# Altium project STM32_CAN_Telemetry_Node.PrjPcb
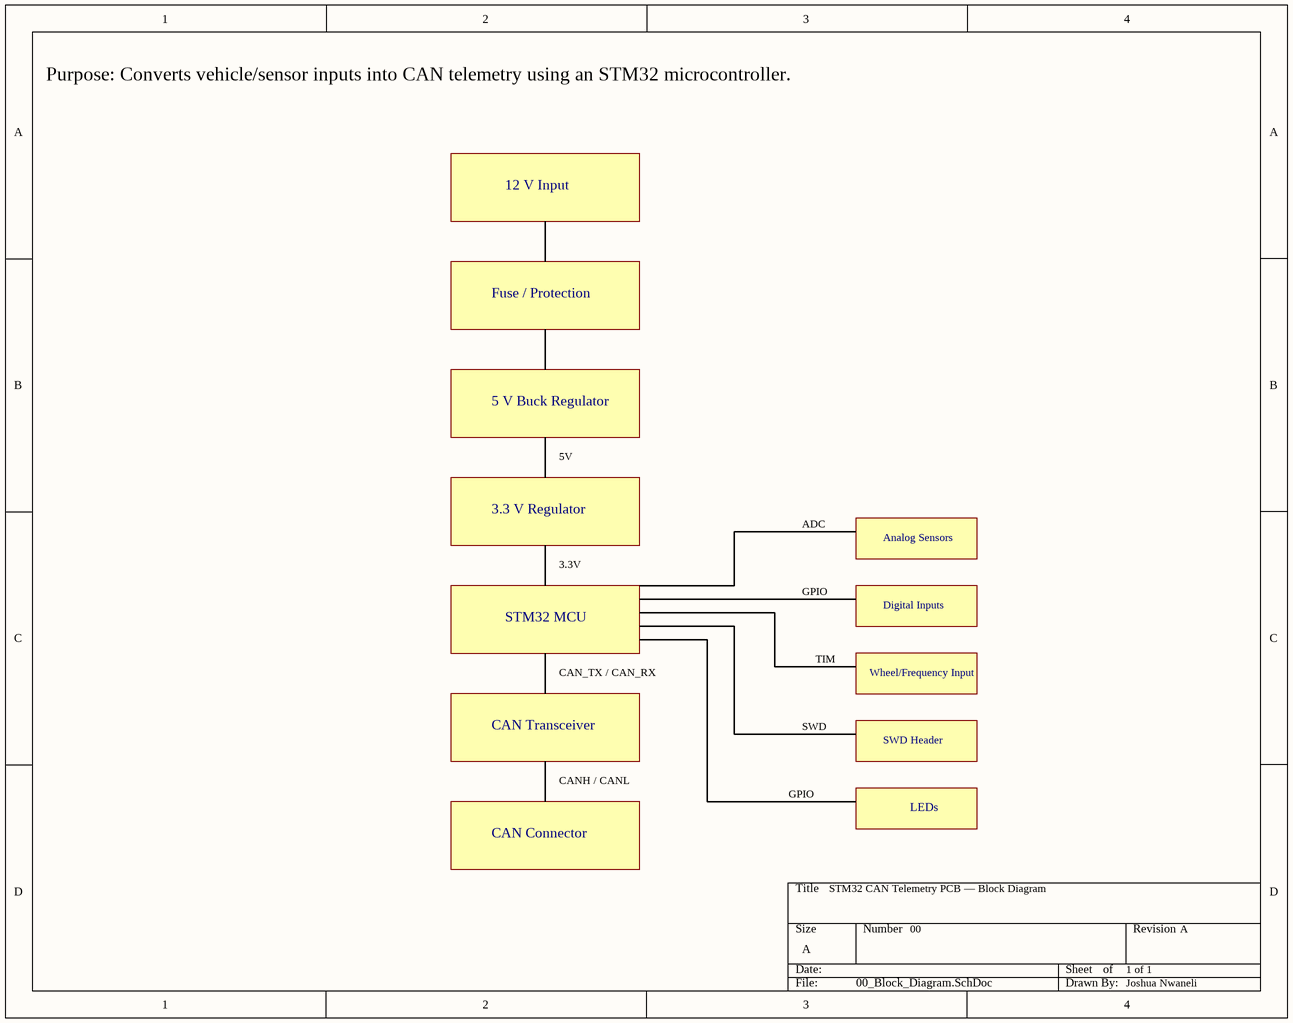
[diagram p0: 00_Block_Diagram.SchDoc]
6 sheets, 72 parts. Net scope: global (net labels, ports and power ports of the same name join across sheets).
Board file: STM32_CAN_Telemetry_Node.PcbDoc
Sheets:
  00_Block_Diagram.SchDoc
  01_Power.SchDoc
  02_MCU.SchDoc
  03_CAN.SchDoc
  04_Sensors_IO.SchDoc
  05_Connectors_Debug.SchDoc

## Sheet 00_Block_Diagram.SchDoc
size A; SheetNumber: 1; SheetTotal: 6

### Notes on the sheet
- Purpose: Converts vehicle/sensor inputs into CAN telemetry using an STM32 microcontroller.
- 12 V Input
- Fuse / Protection
- 5 V Buck Regulator
- 5V
- 3.3 V Regulator
- 3.3V
- ADC
- Analog Sensors
- STM32 MCU
- GPIO
- Digital Inputs
- CAN_TX / CAN_RX
- TIM
- Wheel/Frequency Input
- CAN Transceiver
- SWD
- SWD Header
- CAN Connector
- CANH / CANL
- LEDs
- STM32 CAN Telemetry PCB — Block Diagram
- 00
- 1 of 1
- A
- Joshua Nwaneli

## Sheet 01_Power.SchDoc
size A; SheetNumber: 2; SheetTotal: 6
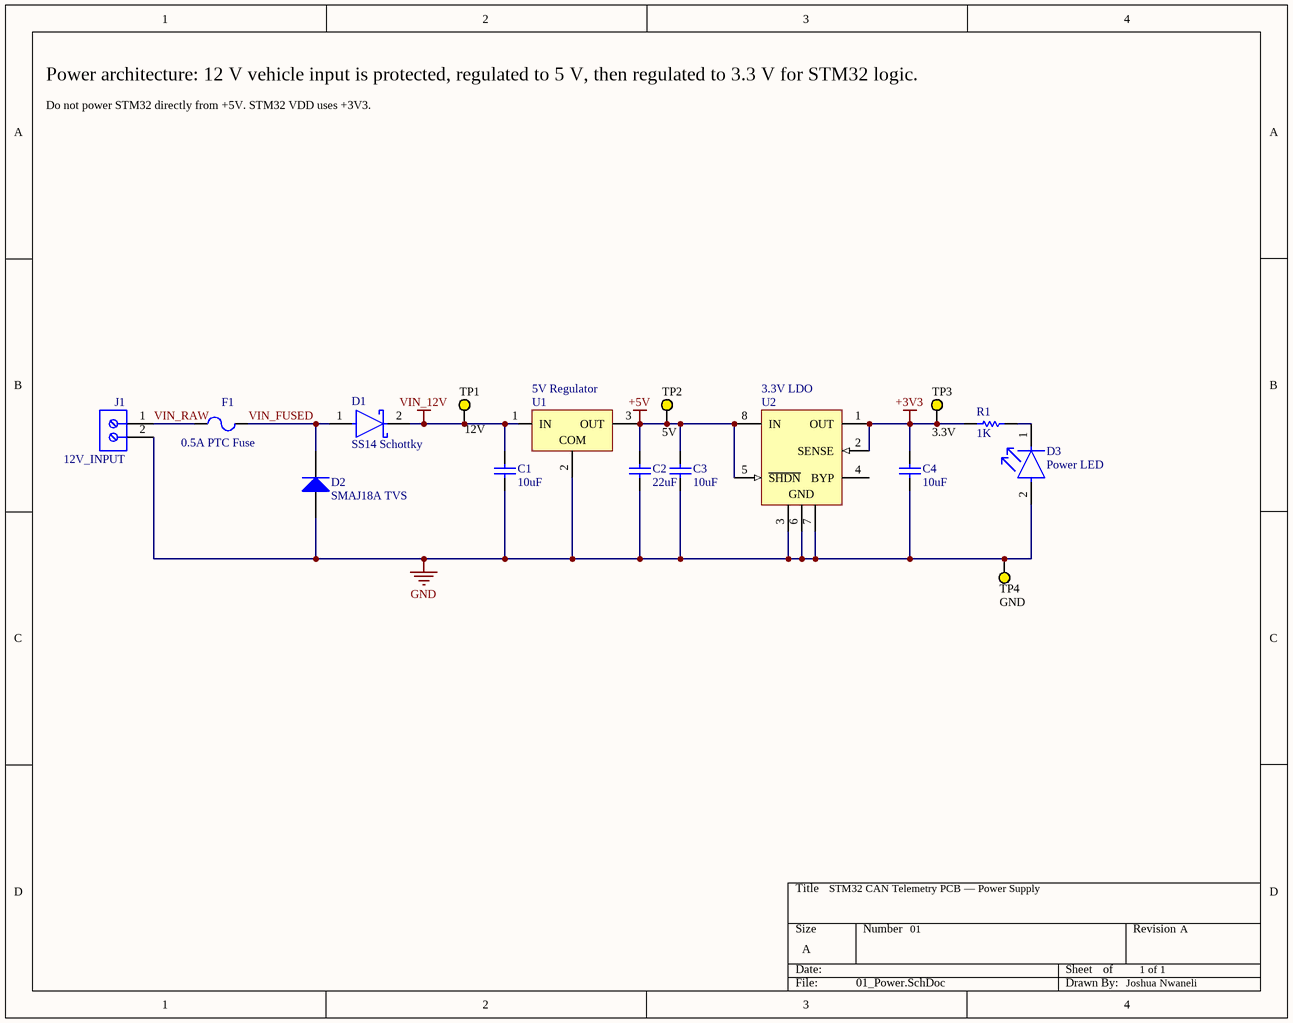
[diagram p1: 01_Power.SchDoc]

### Parts
C1  10uF  [CAPC2013X140X50ML20T25]
C2  22uF  [CAPC1206(3216)190_N]
C3  10uF  [CAPC2013X140X50ML20T25]
C4  10uF  [CAPC2013X140X50ML20T25]
D1  SS14 Schottky  [FP-403AE-MFG]
D2  SMAJ18A TVS  [VISH-DO-214AC-2_M]
D3  Power LED  [FP-SML-LXT0805IW-TR-MFG]
F1  0.5A PTC Fuse  [LFUS-1812L05030PR_V]
J1  12V_INPUT  [691249510002]
R1  1K  [RESC2013X50X30ML20T20]
TP1  12V  [KSTN-5014_V]
TP2  5V  [KSTN-5014_V]
TP3  3.3V  [KSTN-5014_V]
TP4  GND  [KSTN-5014_V]
U1  5V Regulator  [LP3]
U2  3.3V LDO  [LT-S8-8_N]

### Nets
+3V3: C4.2 R1.1 TP3.1 U2.1(OUT) U2.2(SENSE)
+5V: C2.1 C3.2 TP2.1 U1.3(OUT) U2.5(~{SHDN}) U2.8(IN)
GND: C1.1 C2.2 C3.1 C4.1 D2.2(A) D3.2(A) J1.2 TP4.1 U1.2(COM) U2.3(GND) U2.6(GND) U2.7(GND)
VIN_12V: C1.2 D1.2(C) TP1.1 U1.1(IN)
VIN_FUSED: D1.1(A) D2.1(K) F1.2
VIN_RAW: F1.1 J1.1
NetD3_1: D3.1(C) R1.2

Not connected (* = marked no-connect by the designer): U2 4(BYP)

### Notes on the sheet
- Power architecture: 12 V vehicle input is protected, regulated to 5 V, then regulated to 3.3 V for STM32 logic.
- Do not power STM32 directly from +5V. STM32 VDD uses +3V3.
- STM32 CAN Telemetry PCB — Power Supply
- 01
- 1 of 1
- A
- Joshua Nwaneli

### Library data of the parts
C1 C3 C4 = CMP-2007-04702-1: Manufacturer: AVX Interconnect / Elco; Part Number: 0805ZC106KAT2A
C2 = CMP-1037-04990-1: CAP 22uF 10V ±20% 1206 (3216 Metric) Thickness 1.9mm SMD; Tolerance: Â±20%; Case-EIA: 1206; Case-Metric: 3216; Rated Voltage: 10 V; Max Thickness: 1.9 mm; Technology: SMT; Value: 22uF
D1 = CMP-2000-04943-2: DIODE SCHOTTKY 40V 1A SMA; Manufacturer: ON Semiconductor; Peak Reverse Current: 0.2mA; Max Junction Temp: +125°C; Standoff Height: 0.05mm; Max Surge Forward Current: 40A; Mouser Description: Schottky Diodes & Rectifiers SMA 40V 1.0A; RoHS: TRUE; Lead Free: Yes; Manufacturer Part Number: SS14; Device Class L3: Schottky Diodes; Category: Diode; Automotive: No; Digikey Description: DIODE SCHOTTKY 40V 1A SMA; ComponentLink2Description: Datasheet; Device Class L2: Diodes; Height: 2.5mm; Temperature Range High: +125°C; ComponentLink2URL: https://www.onsemi.com/pub/Collateral/SS19-D.PDF; Device Class L1: Discrete Semiconductors; Package: 403AE; Octopart: https://octopart.com/ss14-on+semiconductor-29205033; Max Repetitive Reverse Voltage: 40V; Temperature Range Low: -65°C; Forward Current: 1A; Temperature: -65°C to +125°C
D2 = CMP-0548-00222-2: Transient Voltage Suppressor, 6.40 to 231 V, 18 V Stand-off Voltage, Uni-Directional, -55 to 155 degC, 2-pin DO-214AC, Pb-Free, Tape and Reel; Manufacturer: Vishay Semiconductor; PartNumber: SMAJ18A-E3/61; IFSM: 40 A; PPPM (W): 400, 300; ID (uA): 1; VWM (V): 18; VBR Uni-Directional (V): 6.4 to 231; ComponentLink1URL: http://www.vishay.com/; ComponentLink3URL: http://www.vishay.com/docs/88390/smaj50a.pdf; RoHS: TRUE; Operating Junction and Storage Temperature Range: -55 to 150 degC; ComponentLink2URL: http://www.vishay.com/docs/88390/smaj50a.pdf; ComponentLink1Description: Manufacturer URL; Mounting Technology: Surface Mount; DatasheetVersion: 12/8/2013; PackageDescription: 2-Pin DO-214AC (SMA), Body 4.245 x 2.665 mm; Packing: Tape and Reel; ComponentLink3Description: Package Specification; ComponentLink2Description: Datasheet; PackageReference: DO-214AC-2
D3 = CMP-1724-00002-2: LED RED DIFFUSED SMD; Lens Style: Rectangular; Luminous Intensity: 11mcd; Approvals: UL; Test Current: 20mA; Forward Voltage: 2V; Number of LEDs: 1; Wavelength: 635nm; Lens Color: White; Viewing Angle: 140°; Min Operating Temperature: -25°C; Case Code (Metric): 2012; Mount: Surface Mount; Case Code (Imperial): 0805; Height: 0.8mm; Lead Free: Lead Free; Color: Red; Package Quantity: 1; Illumination Color: Red; Lens Transparency: Diffused; Forward Current: 20mA; Packaging: Tape and Reel; Length: 2mm; Case/Package: 0805; REACH SVHC: No SVHC; Width: 1.25mm; Number of Pins: 2; Max Operating Temperature: 80°C; Dominant Wavelength: 635nm
F1 = CMP-2000-05508-1: PTC Resettable Fuse, 0.8 W, 30 V, -40 to 85 degC, 2-Pin SMD, RoHS, Tape and Reel; Manufacturer: Littelfuse-Inc.; Voltage - Max: 30V; Current - Hold (Ih) (Max): 500mA; Time to Trip: 0.15s; Current - Max: 100A; R Min/Max: 0.150~1.000Ohm; Current - Trip (It): 1A; Package Reference: 1812; Family: PTCResettableFuses; Packaging: Tape&Reel(TR); Package / Case: 1812(4532Metric),Concave; Series: POLY-FUSE®,1812L; Mounting Technology: SurfaceMount; Datasheet Version: 02/2016; Datasheet URL: http://www.littelfuse.com/~/media/electronics/datasheets/resettable_ptcs/littelfuse_ptc_1812l_datasheet.pdf.pdf; Manufacturer URL: http://www.littelfuse.com/; Category: CircuitProtection; Package Description: 2-Pin Surface Mount Device, Body 4.55 x 3.24 mm
J1 = CMP-03913-78871301-2: Terminal Block, 5.08MM Pitch, Double Level Horizontal, 12-30 AWG, 2 Pin; Lead Pitch: 5.08mm; Number of Pins: 2; Packaging: Box
R1 = CMP-2001-04268-1: Manufacturer: Vishay Dale; Part Number: CRCW08051K00FKTC
TP1 = CMP-1672-00006-4: 12V Test Point; Manufacturer: Keystone; PackageDescription: 1-Pin Through Hole Device, Dia 3.17 mm; REACH SVHC: No SVHC; ComponentLink2Description: Datasheet; ComponentLink2URL: http://www.keyelco.com/product-pdf.cfm?p=1323; Package Quantity: 100; Colour: Yellow; Height: 8.12 mm; RoHSCompliant: true; Contact Material: Bronze; Mount: Through Hole; Contact Plating: Silver; ComponentLink1URL: http://www.keyelco.com/; Packaging: Bulk; Mounting Technology: Through Hole; PackageReference: 5014; ComponentLink1Description: Manufacturer URL; DatasheetVersion: Rev. F, 12/2013
TP2 = CMP-1672-00006-4: 5V Test Point; Manufacturer: Keystone; PackageDescription: 1-Pin Through Hole Device, Dia 3.17 mm; REACH SVHC: No SVHC; ComponentLink2Description: Datasheet; ComponentLink2URL: http://www.keyelco.com/product-pdf.cfm?p=1323; Package Quantity: 100; Colour: Yellow; Height: 8.12 mm; RoHSCompliant: true; Contact Material: Bronze; Mount: Through Hole; Contact Plating: Silver; ComponentLink1URL: http://www.keyelco.com/; Packaging: Bulk; Mounting Technology: Through Hole; PackageReference: 5014; ComponentLink1Description: Manufacturer URL; DatasheetVersion: Rev. F, 12/2013
TP3 = CMP-1672-00006-4: 3.3V Test Point; Manufacturer: Keystone; PackageDescription: 1-Pin Through Hole Device, Dia 3.17 mm; REACH SVHC: No SVHC; ComponentLink2Description: Datasheet; ComponentLink2URL: http://www.keyelco.com/product-pdf.cfm?p=1323; Package Quantity: 100; Colour: Yellow; Height: 8.12 mm; RoHSCompliant: true; Contact Material: Bronze; Mount: Through Hole; Contact Plating: Silver; ComponentLink1URL: http://www.keyelco.com/; Packaging: Bulk; Mounting Technology: Through Hole; PackageReference: 5014; ComponentLink1Description: Manufacturer URL; DatasheetVersion: Rev. F, 12/2013
TP4 = CMP-1672-00006-4: Ground Test Point; Manufacturer: Keystone; PackageDescription: 1-Pin Through Hole Device, Dia 3.17 mm; REACH SVHC: No SVHC; ComponentLink2Description: Datasheet; ComponentLink2URL: http://www.keyelco.com/product-pdf.cfm?p=1323; Package Quantity: 100; Colour: Yellow; Height: 8.12 mm; RoHSCompliant: true; Contact Material: Bronze; Mount: Through Hole; Contact Plating: Silver; ComponentLink1URL: http://www.keyelco.com/; Packaging: Bulk; Mounting Technology: Through Hole; PackageReference: 5014; ComponentLink1Description: Manufacturer URL; DatasheetVersion: Rev. F, 12/2013
U1 = CMP-0324-00078-1: Regulates protected 12V input down to 5V; PartNumber: UA78M05IKCSE3; Manufacturer: Texas Instruments; Vout(Max)(V): 5; Eco-Plan: Pb-Free (RoHS); Iout(Max)(A): 0.5; Iq(Typ)(mA): 6; Vin(Max)(V): 25; Vin(Min)(V): 7; ComponentLink2Description: URL Link1; PackageDescription: Plastic Cylindrical Package, Formed Lead Option (TO-92); Mounting Technology: Through Hole; Vout(Min)(V): 5; PackageVersion: revC, Oct-2001; PackageReference: LP3; Code_JEDEC: TO-226-AA; ComponentLink1URL: http://www.ti.com/general/docs/lit/getliterature.tsp?genericPartNumber=UA78M05&fileType=pdf; DatasheetVersion: SLVS059Q; ComponentLink2URL: Samples URL:http://www.ti.com/product/ua78m05#samples; ComponentLink1Description: Datasheet
U2 = CMP-0476-01566-1: 500 mA, Low Noise, LDO Micropower Regulator, 1.8 to 20 V Vin, 3.3 V Vout, 8-pin SOIC (S8-8), -40 to 125 degC, Pb-Free; Manufacturer: Linear Technology; PartNumber: LT1763IS8-3.3#PBF; Shutdown Current(uA): 1; Vin Min(V): 1.8; Iout(mA): 500; Noise(uV): 20; Isupply(mA): 0.03; Discrete Pass Element: no; PSRR(dB): 65; Dropout Voltage(V): 0.3; ComponentLink3URL: http://cds.linear.com/docs/en/packaging/05081610_G_SO8.pdf; Number of Outputs: 1; ComponentLink2URL: http://cds.linear.com/docs/en/datasheet/1763fg.pdf; ComponentLink1Description: Manufacturer URL; PackageReference: S8-8; DatasheetVersion: Rev. G; ComponentLink3Description: Package Specification; ComponentLink2Description: Datasheet; Output Voltage: 3.3 V; Mounting Technology: Surface Mount; Vin Max(V): 20; ComponentLink1URL: http://www.linear.com/; PackageDescription: 8-Pin Plastic Small Outline (Narrow .150 Inch), Body 4.9 x 3.9 mm, Pitch 1.27 mm; RoHS: TRUE; PackageVersion: Rev. G, 03/2012

## Sheet 02_MCU.SchDoc
size A; SheetNumber: 3; SheetTotal: 6
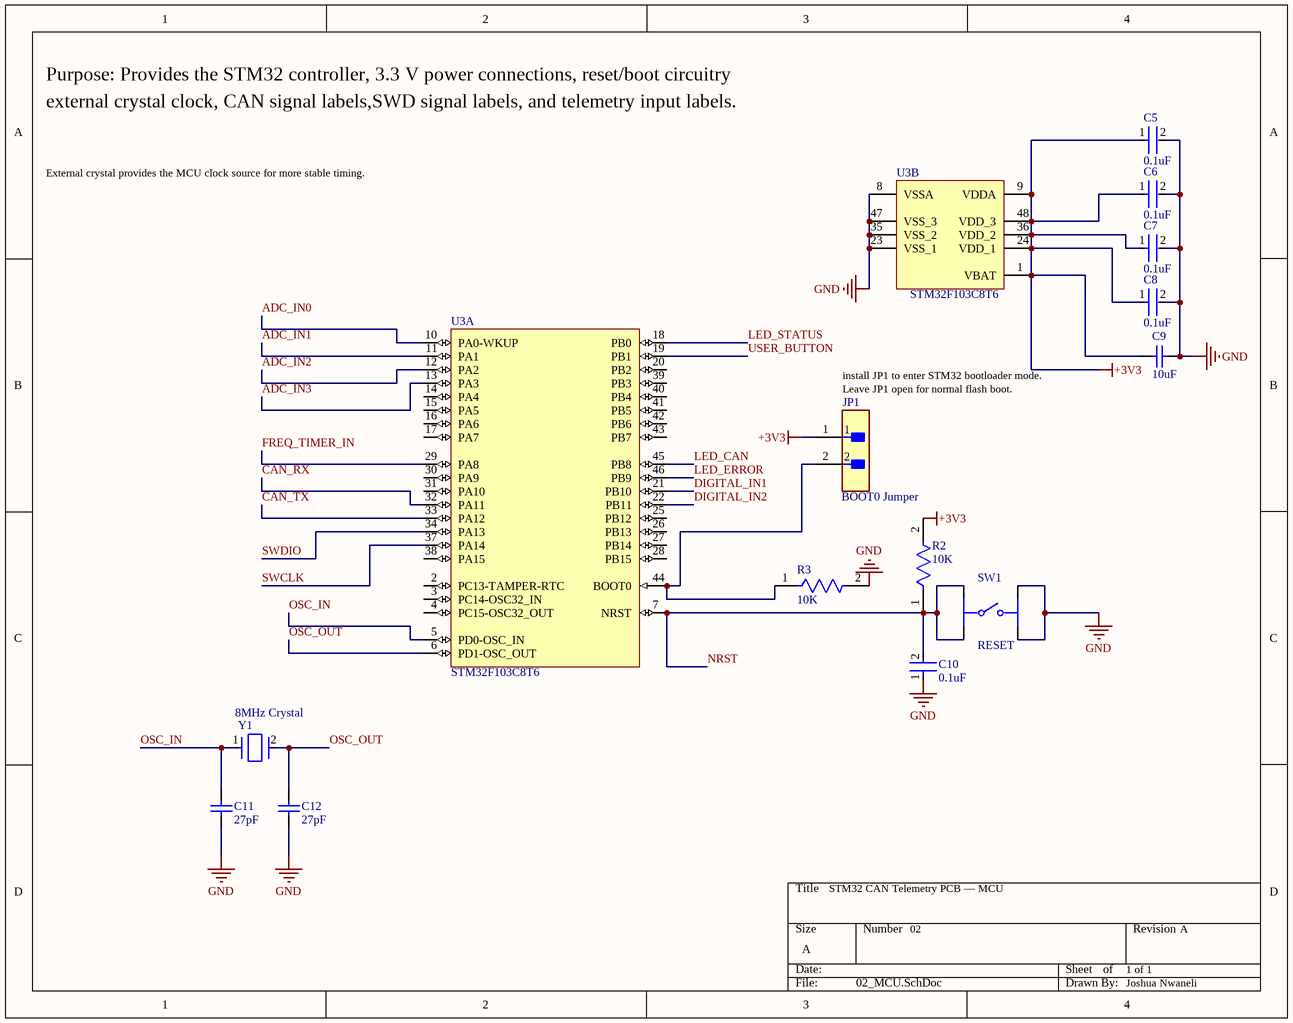
[diagram p2: 02_MCU.SchDoc]

### Parts
C5  0.1uF  [FP-CC0805-EB-MFG]
C6  0.1uF  [FP-CC0805-EB-MFG]
C7  0.1uF  [FP-CC0805-EB-MFG]
C8  0.1uF  [FP-CC0805-EB-MFG]
C9  10uF  [CAPC2013X140X50ML20T25]
C10  0.1uF  [FP-CC0805-EB-MFG]
C11  27pF  [CAPC0603X33X15ML03T05]
C12  27pF  [CAPC0603X33X15ML03T05]
JP1  BOOT0 Jumper  [FP-TSW-102-12-T-S-MFG]
R2  10K  [FP-CRGP0805-IPC_C]
R3  10K  [FP-CRGP0805-IPC_C]
SW1  RESET  [FP-7914J-1-032-MFG]
U3  STM32F103C8T6  [STM-LQFP48_L]  (parts A,B of 2)
Y1  8MHz Crystal  [FP-ABLS-MFG]

### Nets
+3V3: C5.1 C6.1 C7.1 C8.1 C9.2 JP1.1 R2.2 U3.1(VBAT) U3.9(VDDA) U3.24(VDD_1) U3.36(VDD_2) U3.48(VDD_3)
GND: C5.2 C6.2 C7.2 C8.2 C9.1 C10.1 C11.1 C12.1 R3.2 SW1.1_2+(1_2+) SW1.2_2+(2_2+) U3.8(VSSA) U3.23(VSS_1) U3.35(VSS_2) U3.47(VSS_3)
ADC_IN0: U3.10(PA0-WKUP)
ADC_IN1: U3.11(PA1)
ADC_IN2: U3.12(PA2)
ADC_IN3: U3.13(PA3)
CAN_RX: U3.32(PA11)
CAN_TX: U3.33(PA12)
DIGITAL_IN1: U3.21(PB10)
DIGITAL_IN2: U3.22(PB11)
FREQ_TIMER_IN: U3.29(PA8)
LED_CAN: U3.45(PB8)
LED_ERROR: U3.46(PB9)
LED_STATUS: U3.18(PB0)
NRST: C10.2 R2.1 SW1.1_1-(1_1-) SW1.2_1-(2_1-) U3.7(NRST)
OSC_IN: C11.2 U3.5(PD0-OSC_IN) Y1.1
OSC_OUT: C12.2 U3.6(PD1-OSC_OUT) Y1.2
SWCLK: U3.37(PA14)
SWDIO: U3.34(PA13)
USER_BUTTON: U3.19(PB1)
NetJP1_2: JP1.2 R3.1 U3.44(BOOT0)

Not connected (* = marked no-connect by the designer): U3 2(PC13-TAMPER-RTC) 3(PC14-OSC32_IN) 4(PC15-OSC32_OUT) 14(PA4) 15(PA5) 16(PA6) 17(PA7) 20(PB2) 25(PB12) 26(PB13) 27(PB14) 28(PB15) 30(PA9) 31(PA10) 38(PA15) 39(PB3) 40(PB4) 41(PB5) 42(PB6) 43(PB7)

### Notes on the sheet
- Purpose: Provides the STM32 controller, 3.3 V power connections, reset/boot circuitry
- external crystal clock, CAN signal labels,SWD signal labels, and telemetry input labels.
- External crystal provides the MCU clock source for more stable timing.
- install JP1 to enter STM32 bootloader mode.
- (near JP1) Leave JP1 open for normal flash boot.
- STM32 CAN Telemetry PCB — MCU
- 02
- 1 of 1
- A
- Joshua Nwaneli

### Library data of the parts
C5-C8 C10 = CMP-00621-107850848-1: CC0805KKX7RYBB104 Capacitor Ceramic 0.01uF 250V X7R 10% 0805 T/R; Capacitance: 100nF; Material: Ceramic; Max Operating Temperature: 125°C; Tolerance: 10%; Case/Package: 0805; NexarPartId: 107850848; Height: 1.45mm; Min Operating Temperature: -55°C; Voltage Rating: 250V
C9 = CMP-2007-04702-1: as C1 on sheet 01_Power
C11 C12 = CMP-2010-00173-1: Manufacturer: AVX Interconnect / Elco; Part Number: 0201YA270JAT2A
JP1 = CMP-02766-001444-1: CONN HEADER VERT 2POS 2.54MM; Gender: Male; Number of Contacts: 2; RoHS Compliant: Yes; Mount: Through Hole; Termination: Solder; Packaging: Bulk; Contact Material: Bronze; Contact Plating: Tin; Number of Rows: 1; REACH SVHC: No SVHC; Pitch: 2.54mm; Radiation Hardening: No
R2 R3 = CMP-03211-006861-1: CRGP 0805 10K 1%; Manufacturer Part Number: CRGP0805F10K; Manufacturer: TE; Power Rating: 0.33W; Description: CRGP0805 10KΩ 0.33W ±100ppm/°C 1% 150V; Voltage Rating: 150V; Value: 10KΩ; Tolerance: 0.01; Temperature Coefficient: ±100ppm/°C; ComponentLink2URL: https://www.mouser.com/datasheet/2/418/NG_DS_9-1773463-9_A-1358566.pdf; Temperature Range Low: -55°C; Ipc Land Pattern Name: RESC200125X55; Device Class L2: Resistors; Automotive: No; Device Class L3: Chip SMD Resistors; Composition: Thick Film; Temperature Range High: +155°C; Temperature: -55°C to +155°C; Height: 0.65mm; Series: CRGP; RoHS: TRUE; Device Class L1: Passive Components; Octopart: https://octopart.com/crgp0805f10k-te+connectivity-91018782; Package: CRGP0805; Digikey Description: CRGP 0805 10K 1%; Ambient Temperature Range High: +70°C; Lead Free: Yes; ComponentLink2Description: Datasheet; Category: Res; Resistance: 10KΩ
SW1 = CMP-07427-000007-1: Normally open reset pushbutton for STM32 NRST; Mechanical Life: 100000Cycles; Switch Function: Off-Mom; Actuator Material: Rubber; Illumination Type: Non-Illuminated; Actuator Type: Standard; Operating Force: 300gf; Throw Configuration: SPST; Current Rating: 100mA; Voltage Rating (DC): 16V; Contact Plating: Silver; Min Operating Temperature: -55°C; Series: 7914; Package Quantity: 50; Max Operating Temperature: 125°C; Depth: 5mm; Termination: J-Hook; Mount: Surface Mount; RoHS Compliant: Yes; Case/Package: SMD/SMT; Orientation: Straight; Max Current Rating: 100mA; Packaging: Rail/Tube; Length: 5mm; Contact Material: Gold
U3 = CMP-0237-00215-3: ARM Cortex-M3 32-bit MCU, 64 KB Flash, 20 KB Internal RAM, 37 I/Os, 48-pin LQFP, -40 to 85 degC, Tray; Supply Voltage(Vcc) min (V): 2; Internal RAM Size (kB): 20; FLASH Size (Prog) (kB): 64; A/D Converter: 2x12-bit (10 Channel); I/Os (High Current): 37; Operating Frequency(F) (Processor speed) (MHz): 72; Core: ARM Cortex-M3; ComponentLink3Description: Package Specification; Mounting Technology: Surface Mount; PartNumber: STM32F103C8T6; PackageReference: LQFP48; Packing: Tray; ComponentLink3URL: http://www.st.com/st-web-ui/static/active/en/resource/technical/document/datasheet/DM00058181.pdf; DatasheetVersion: Rev. 16; ComponentLink1URL: http://www.st.com/web/en/home.html; PackageVersion: Rev. 6, 06/2013; ComponentLink2URL: http://www.st.com/st-web-ui/static/active/en/resource/technical/document/datasheet/CD00161566.pdf; ComponentLink1Description: Manufacturer URL; ComponentLink2Description: Datasheet; PackageDescription: 48-Pin Low Profile Quad Flat Package, 7 x 7 mm Body, 0.5 mm Pitch
Y1 = CMP-27762-009874-1: CRYSTAL 8.0000MHZ 18PF SMD; ESR (Equivalent Series Resistance): 80R; Frequency Stability: 50ppm; Tolerance: 20ppm; Min Operating Temperature: -20°C; Lead Free: Lead Free; Operating Frequency: 8 MHz; Width: 4.7mm; Packaging: Tape and Reel; Series: ABLS; Accuracy: 20ppm; Length: 11.4mm; Frequency Tolerance: 20ppm; Termination: SMD/SMT; Number of Pins: 2; Radiation Hardening: No; Depth: 4.7mm; REACH SVHC: No SVHC; Contact Plating: Tin; Load Capacitance: 18pF; Case/Package: SMD/SMT; Mount: Surface Mount; Package Quantity: 1000; Max Operating Temperature: 70°C; Height: 0.165inch; Frequency: 8MHz; Series Resistance: 80R

## Sheet 03_CAN.SchDoc
size A; SheetNumber: 4; SheetTotal: 6
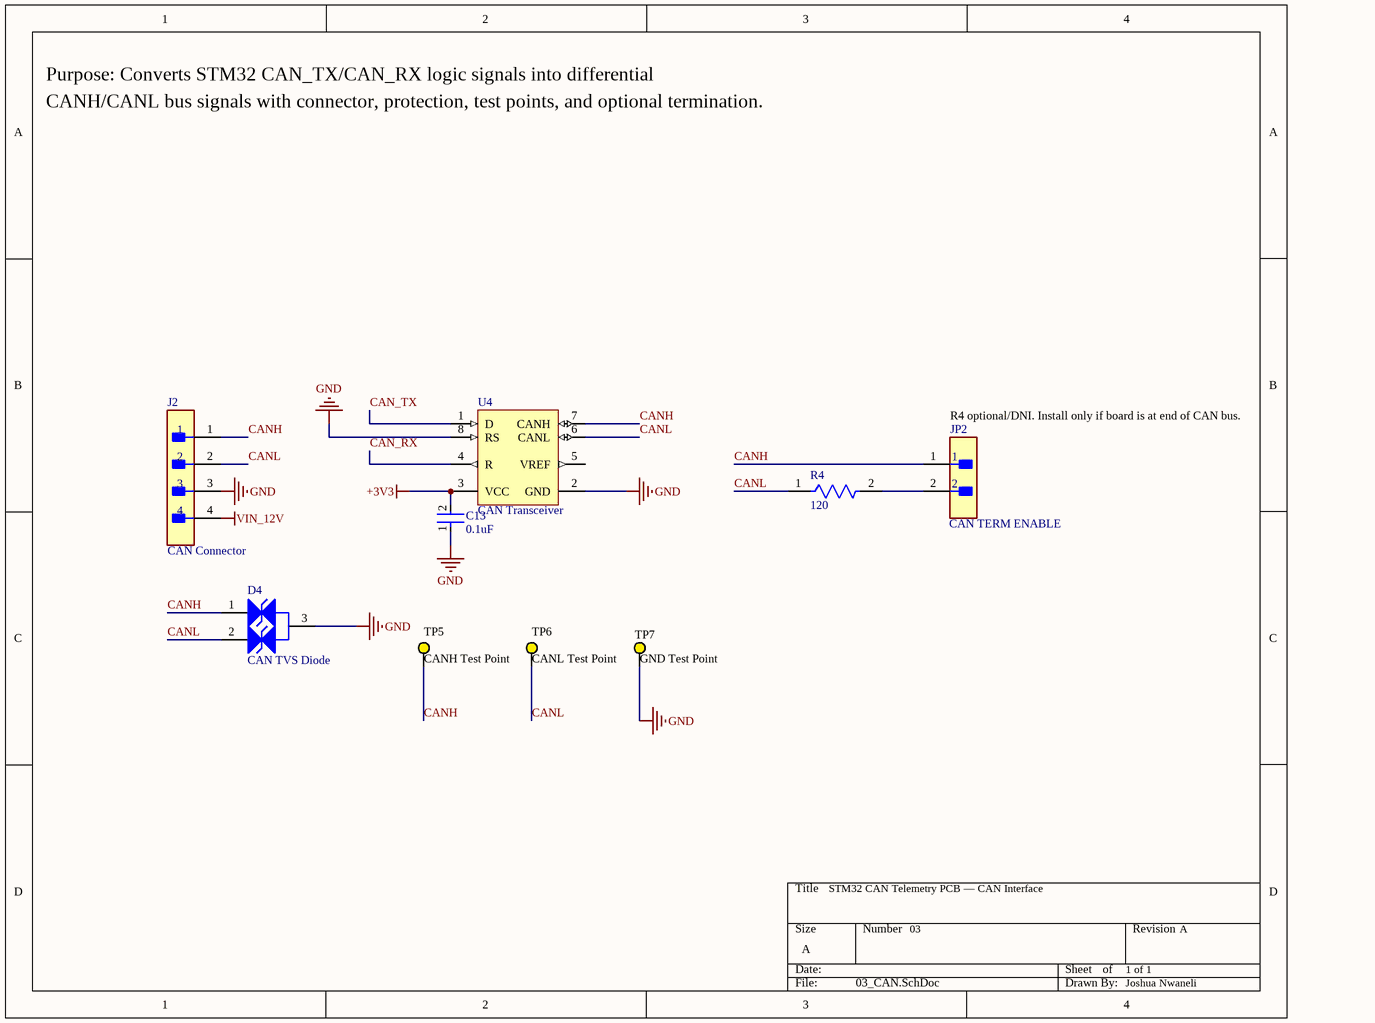
[diagram p3: 03_CAN.SchDoc]

### Parts
C13  0.1uF  [FP-CC0805-EB-MFG]
D4  CAN TVS Diode  [ONSC-SOT-23-3-318-08_V]
J2  CAN Connector  [FP-1777099-MFG]
JP2  CAN TERM ENABLE  [FP-TSW-102-12-T-S-MFG]
R4  120  [FP-RT0805-MFG]
TP5  CANH Test Point  [KSTN-5014_V]
TP6  CANL Test Point  [KSTN-5014_V]
TP7  GND Test Point  [KSTN-5014_V]
U4  CAN Transceiver  [D0008A_M]

### Nets
+3V3: C13.2 U4.3(VCC)
GND: C13.1 D4.3(K) J2.3 TP7.1 U4.2(GND) U4.8(RS)
VIN_12V: J2.4
CAN_RX: U4.4(R)
CAN_TX: U4.1(D)
CANH: D4.1(K) J2.1 JP2.1 TP5.1 U4.7(CANH)
CANL: D4.2(K) J2.2 R4.1 TP6.1 U4.6(CANL)
NetJP2_2: JP2.2 R4.2

Not connected (* = marked no-connect by the designer): U4 5(VREF)

### Notes on the sheet
- Purpose: Converts STM32 CAN_TX/CAN_RX logic signals into differential
- CANH/CANL bus signals with connector, protection, test points, and optional termination.
- Type @ to refer to a designator
- (near JP2) R4 optional/DNI. Install only if board is at end of CAN bus.
- STM32 CAN Telemetry PCB — CAN Interface
- 03
- 1 of 1
- A
- Joshua Nwaneli

### Library data of the parts
C13 = CMP-00621-107850848-1: as C5 on sheet 02_MCU; Material: Ceramic; Max Operating Temperature: 125°C; Tolerance: 10%; Case/Package: 0805; NexarPartId: 107850848; Height: 1.45mm; Min Operating Temperature: -55°C; Voltage Rating: 250V
D4 = CMP-1063-00169-1: Dual-line ESD/transient protection for CANH and CANL; Manufacturer: On Semiconductor; PartNumber: SZNUP2105LT3G; V(BR) Min (V): 26.2; Number of Lines: 2; Direction: Bidirectional; Packing: Tape and Reel; C Max (pF): 30; PPK Max (W): 350; IR Max (uA): 0.1; Mounting Technology: Surface Mount; ComponentLink1Description: Manufacturer URL; PackageDescription: 3-Pin Small Outline Transistor, Body 2.92 x 1.3 mm, Pitch 0.95 mm; PackageReference: SOT-23-3-318-08; ComponentLink1URL: http://www.onsemi.com/; PackageVersion: Rev. AP, 11/2009; DatasheetVersion: Rev. 5; RoHS: Pb-Free; ComponentLink2Description: Datasheet; ComponentLink2URL: http://www.onsemi.cn/pub_link/Collateral/NUP2105L-D.PDF; ComponentLink3Description: Package Specification; ComponentLink3URL: http://www.onsemi.cn/pub_link/Collateral/318-08.PDF
J2 = CMP-09399-000012-1: TERM BLOCK HDR 4POS VERT 5.08MM; Number of Levels: 1; Voltage: 300V; Max Current Rating: 12A; Number of Contacts: 4; Connector Type: Plug; Voltage Rating: 250V; Length: 30.48mm; Lead Free: Lead Free; Number of Rows: 1; Package Quantity: 50; Housing Material: Polybutylene; Height: 15.9mm; Color: Green; Termination: Solder; Depth: 8.3mm; Contact Plating: Tin; Flammability Rating: UL94 V-0; Mount: Through Hole; Width: 30.48mm; Packaging: Bulk; Orientation: Straight; Contact Material: Tin; Housing Color: Green; Pitch: 5.08mm; Current Rating: 12A; Current: 12A; Weight: 5.467464oz; Series: MSTBV; Number of Positions Per Level: 4; Number of Positions: 4
JP2 = CMP-02766-001444-1: Jumper to enable optional 120R CAN bus termination; Gender: Male; Number of Contacts: 2; Pitch: 2.54mm; RoHS Compliant: Yes; Mount: Through Hole; Termination: Solder; Packaging: Bulk; Contact Material: Bronze; Contact Plating: Tin; Number of Rows: 1; REACH SVHC: No SVHC; Radiation Hardening: No
R4 = CMP-03412-026588-1: RES SMD 120 OHM 0.5% 1/8W 0805; Manufacturer: Yageo; Manufacturer Part Number: RT0805DRD07120RL; Temperature Coefficient: 25 ppm/°C; Description: RT0805 120Ω 0.125W 25 ppm/°C 1.00%; Tolerance: 0.01; Resistance: 120Ω; Power Rating: 0.125W; Value: 120Ω; Voltage Rating: 150V; Octopart: https://octopart.com/rt0805drd07120rl-yageo-1204488; Digikey Description: RES SMD 120 OHM 0.5% 1/8W 0805; ComponentLink2Description: Datasheet; Device Class L1: Passive Components; Automotive: No; Temperature Range High: +155°C; RoHS: TRUE; Composition: Thin Film; Package: RT0805; Device Class L3: Chip SMD Resistors; Category: Res; Footprint Url: http://www.yageo.com/exep/pages/download/literatures/PYu-R_Mount_10.pdf; Temperature: -55°C to +155°C; Height: 0.6mm; Lead Free: Yes; ComponentLink2URL: http://www.yageo.com/documents/recent/PYu-RT_1-to-0.01_RoHS_L_9.pdf; Series: RT; Temperature Range Low: -55°C; Ipc Land Pattern Name: RESC200125X50; Device Class L2: Resistors
TP5-TP7 = CMP-1672-00006-4: Test Point, Yellow, Through Hole, RoHS, Bulk; Manufacturer: Keystone; PackageDescription: 1-Pin Through Hole Device, Dia 3.17 mm; REACH SVHC: No SVHC; ComponentLink2Description: Datasheet; ComponentLink2URL: http://www.keyelco.com/product-pdf.cfm?p=1323; Package Quantity: 100; Colour: Yellow; Height: 8.12 mm; RoHSCompliant: true; Contact Material: Bronze; Mount: Through Hole; Contact Plating: Silver; ComponentLink1URL: http://www.keyelco.com/; Packaging: Bulk; Mounting Technology: Through Hole; PackageReference: 5014; ComponentLink1Description: Manufacturer URL; DatasheetVersion: Rev. F, 12/2013
U4 = CMP-0315-00046-3: CAN Bus Transceiver, 3.3 V, -40 to 85 degC, 8-Pin SOIC (D), Green (RoHS & no Sb/Br), Tube; PartNumber: SN65HVD230D; Generic Part Number: SN65HVD230; Supply Voltage Min: 3 V; Supply Voltage Max: 3.6 V; ComponentLink2URL: http://www.ti.com/general/docs/lit/getliterature.tsp?genericGeneric Part Number=SN65HVD230&fileType=pdf; DatasheetVersion: SLOS346N; Packing: Tube; Temperature Min: -40 degC; Temperature Max: 85 degC; ComponentLink1Description: Manufacturer URL; Mounting Technology: Surface Mount; RoHS: TRUE; ComponentLink1URL: http://www.ti.com/; ComponentLink2Description: Datasheet; PackageDescription: 8-Pin Plastic Small Outline, Body 4.9 x 3.9 mm, Pitch 1.27 mm

## Sheet 04_Sensors_IO.SchDoc
size A; SheetNumber: 5; SheetTotal: 6
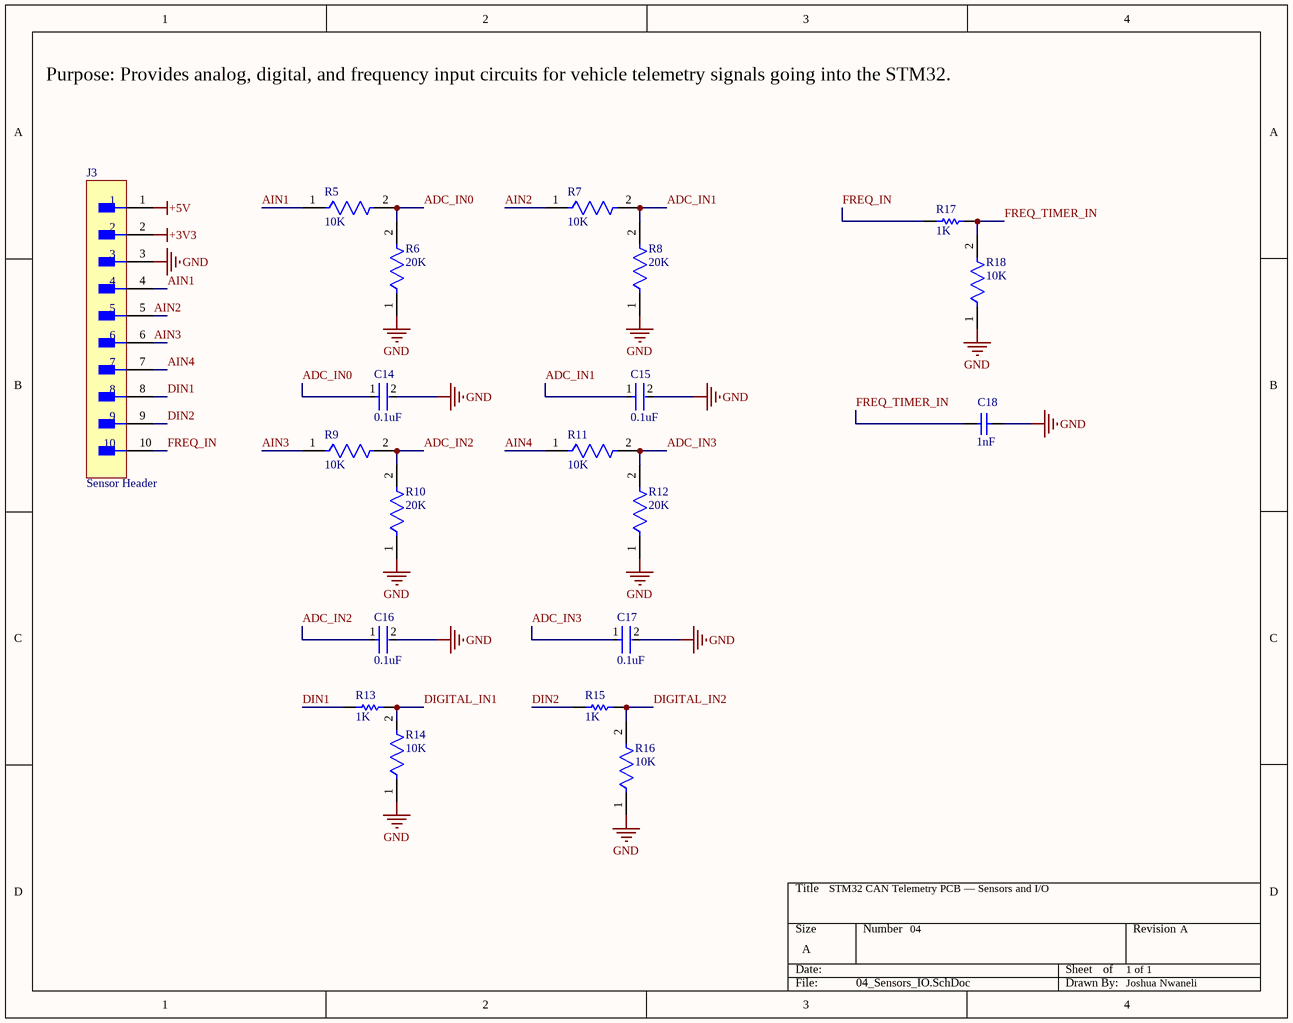
[diagram p4: 04_Sensors_IO.SchDoc]

### Parts
C14  0.1uF  [FP-CC0805-EB-MFG]
C15  0.1uF  [FP-CC0805-EB-MFG]
C16  0.1uF  [FP-CC0805-EB-MFG]
C17  0.1uF  [FP-CC0805-EB-MFG]
C18  1nF  [CAPC2013X127X50NL20T25]
J3  Sensor Header  [FP-TSW-110-07-T-S-MFG]
R5  10K  [FP-CRGP0805-IPC_C]
R6  20K  [FP-RN732A-MFG]
R7  10K  [FP-CRGP0805-IPC_C]
R8  20K  [FP-RN732A-MFG]
R9  10K  [FP-CRGP0805-IPC_C]
R10  20K  [FP-RN732A-MFG]
R11  10K  [FP-CRGP0805-IPC_C]
R12  20K  [FP-RN732A-MFG]
R13  1K  [RESC2013X50X30ML20T20]
R14  10K  [FP-CRGP0805-IPC_C]
R15  1K  [RESC2013X50X30ML20T20]
R16  10K  [FP-CRGP0805-IPC_C]
R17  1K  [RESC2013X50X30ML20T20]
R18  10K  [FP-CRGP0805-IPC_C]

### Nets
+3V3: J3.2
+5V: J3.1
GND: C14.2 C15.2 C16.2 C17.2 C18.2 J3.3 R6.1 R8.1 R10.1 R12.1 R14.1 R16.1 R18.1
ADC_IN0: C14.1 R5.2 R6.2
ADC_IN1: C15.1 R7.2 R8.2
ADC_IN2: C16.1 R9.2 R10.2
ADC_IN3: C17.1 R11.2 R12.2
AIN1: J3.4 R5.1
AIN2: J3.5 R7.1
AIN3: J3.6 R9.1
AIN4: J3.7 R11.1
DIGITAL_IN1: R13.2 R14.2
DIGITAL_IN2: R15.2 R16.2
DIN1: J3.8 R13.1
DIN2: J3.9 R15.1
FREQ_IN: J3.10 R17.1
FREQ_TIMER_IN: C18.1 R17.2 R18.2

### Notes on the sheet
- Purpose: Provides analog, digital, and frequency input circuits for vehicle telemetry signals going into the STM32.
- STM32 CAN Telemetry PCB — Sensors and I/O
- 04
- 1 of 1
- A
- Joshua Nwaneli

### Library data of the parts
C14-C17 = CMP-00621-107850848-1: as C5 on sheet 02_MCU; Material: Ceramic; Max Operating Temperature: 125°C; Tolerance: 10%; Case/Package: 0805; NexarPartId: 107850848; Height: 1.45mm; Min Operating Temperature: -55°C; Voltage Rating: 250V
C18 = CMP-2007-04833-1: Part Number: 08052C102MAT2A; Manufacturer: AVX Interconnect / Elco
J3 = CMP-00575-00272505-1: TSW-110-07-T-S TSW - Samtec 2.54mm Pin Header 10.92mm Overall Pin Length (07) (mcv)(TO22); Manufacturer Lifecycle Status: PRODUCTION; Connector Type: Male Pin; Number of Positions: 10; Max Current Rating: 7.6A; Gender: Male; Max Voltage Rating (AC): 550V; Max Operating Temperature: 105°C; Packaging: Bulk; Lead Free: Lead Free; Min Operating Temperature: -55°C; Width: 2.54mm; RoHS: Compliant; Depth: 2.54mm; Lifecycle Status: Production; REACH SVHC: No SVHC; Height: 8.71mm; Number of Rows: 1; Housing Material: Polyester; Orientation: Straight; Radiation Hardening: No; Number of Contacts: 10; Housing Color: Black; Mount: Through Hole; Lead Pitch: 2.54mm; Termination: Solder; Color: Black; Contact Material: Nickel, Tin; Number of Pins: 10; Length: 25.4mm; Pitch: 2.54mm; Contact Plating: Tin; Contact Mating Length: 5.842mm
R5 R7 R9 R11 R14 R16 R18 = CMP-03211-006861-1: CRGP 0805 10K 1%; Manufacturer Part Number: CRGP0805F10K; Manufacturer: TE; Power Rating: 0.33W; Voltage Rating: 150V; Value: 10KΩ; Tolerance: 0.01; Temperature Coefficient: ±100ppm/°C; ComponentLink2URL: https://www.mouser.com/datasheet/2/418/NG_DS_9-1773463-9_A-1358566.pdf; Temperature Range Low: -55°C; Ipc Land Pattern Name: RESC200125X55; Device Class L2: Resistors; Automotive: No; Device Class L3: Chip SMD Resistors; Composition: Thick Film; Temperature Range High: +155°C; Temperature: -55°C to +155°C; Height: 0.65mm; Series: CRGP; RoHS: TRUE; Device Class L1: Passive Components; Octopart: https://octopart.com/crgp0805f10k-te+connectivity-91018782; Package: CRGP0805; Digikey Description: CRGP 0805 10K 1%; Ambient Temperature Range High: +70°C; Lead Free: Yes; ComponentLink2Description: Datasheet; Category: Res; Resistance: 10KΩ
R6 R8 R10 R12 = CMP-03211-001671-1: SMD Chip Resistor, Thin Film, 20KΩ, 100 V, 0805 [2012 Metric], 100 mW, 0.1%, RN73 Series; Manufacturer: TE Connectivity; Manufacturer Part Number: RN73C2A20KBTDF; Power Rating: 0.1W; Temperature Coefficient: 10ppm/°C; Voltage Rating: 100V; ComponentLink2URL: https://www.te.com/commerce/DocumentDelivery/DDEController?Action=showdoc&DocId=Data+Sheet%7F1773270%7FP%7Fpdf%7FEnglish%7FENG_DS_1773270_P.pdf%7F1676162-2; RoHS: TRUE; Category: Res; Temperature Range Low: -55°C; octopart_url: https://octopart.com/rn73c2a20kbtdf-te+connectivity-21411984; Resistance: 20KΩ; Value: 20KΩ; Temperature: -55°C to 155°C; Device Class L3: Chip SMD Resistors; Lead Free: Yes; Automotive: No; packaging: 1000 Reel; Device Class L2: Resistors; Octopart: https://octopart.com/rn73c2a20kbtdf-te+connectivity-21411984; Temperature Range High: 155°C; Device Class L1: Passive Components; Height: 0.65mm; ComponentLink2Description: Datasheet; Package: RN732A; Ipc Land Pattern Name: RESC200125X55; Composition: Thin Film; Series: RN73; Tolerance: 0.1%
R13 R15 R17 = CMP-2001-04268-1: as R1 on sheet 01_Power

## Sheet 05_Connectors_Debug.SchDoc
size A; SheetNumber: 6; SheetTotal: 6
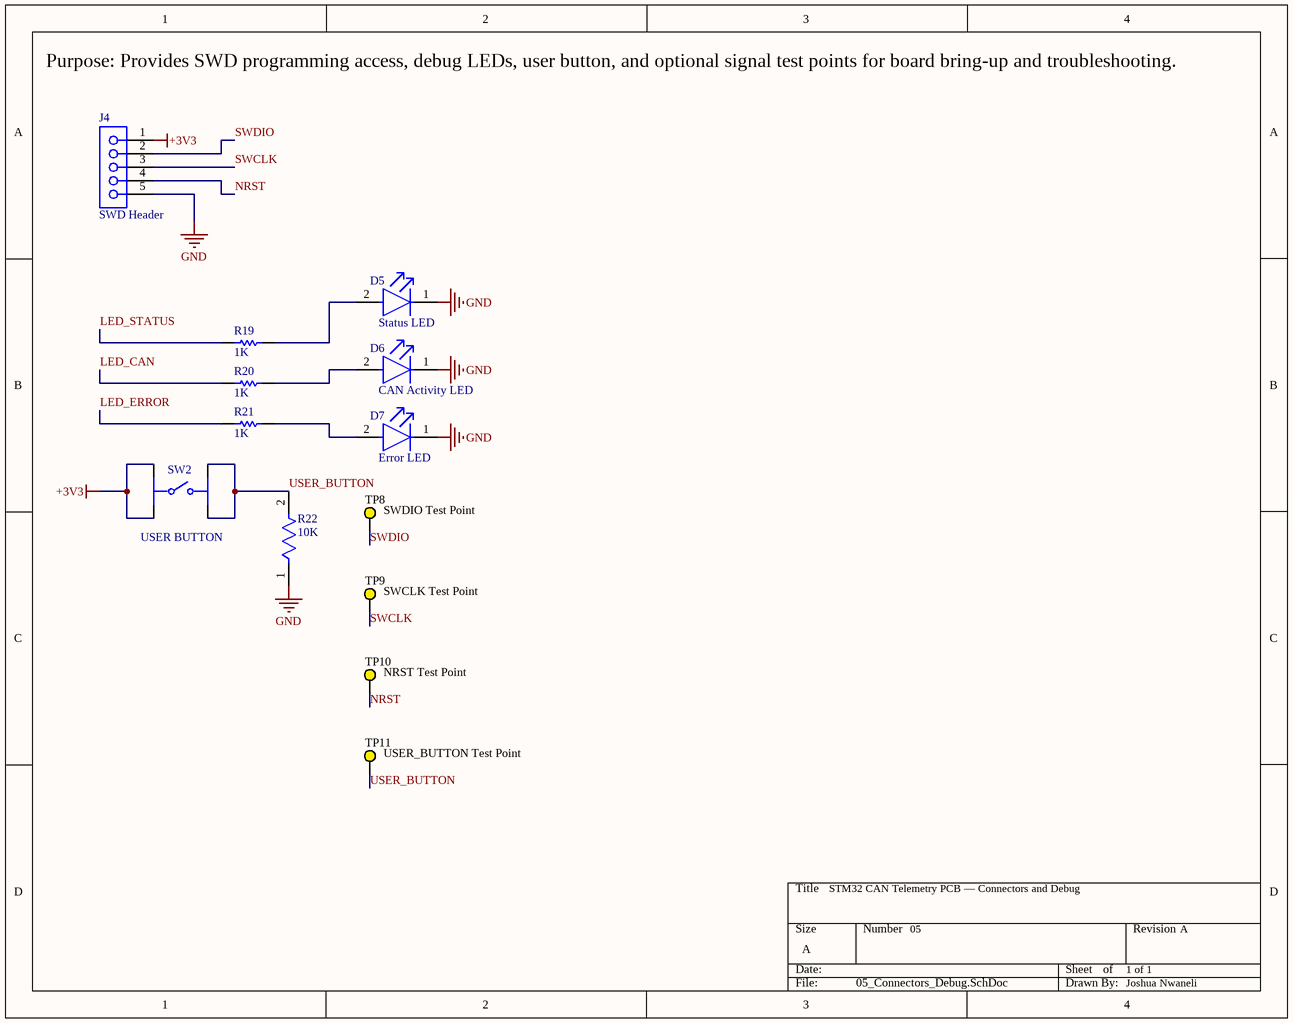
[diagram p5: 05_Connectors_Debug.SchDoc]

### Parts
D5  Status LED  [FP-SML-LXT0805IW-TR-MFG]
D6  CAN Activity LED  [FP-SML-LXT0805IW-TR-MFG]
D7  Error LED  [FP-SML-LXT0805IW-TR-MFG]
J4  SWD Header  [SMTC-SSW-105-01-X-S]
R19  1K  [RESC2013X50X30ML20T20]
R20  1K  [RESC2013X50X30ML20T20]
R21  1K  [RESC2013X50X30ML20T20]
R22  10K  [FP-CRGP0805-IPC_C]
SW2  USER BUTTON  [FP-7914J-1-032-MFG]
TP8  SWDIO Test Point  [KSTN-5014_V]
TP9  SWCLK Test Point  [KSTN-5014_V]
TP10  NRST Test Point  [KSTN-5014_V]
TP11  USER_BUTTON Test Point  [KSTN-5014_V]

### Nets
+3V3: J4.1 SW2.1_1-(1_1-) SW2.2_1-(2_1-)
GND: D5.1(C) D6.1(C) D7.1(C) J4.5 R22.1
LED_CAN: R20.1
LED_ERROR: R21.1
LED_STATUS: R19.1
NRST: J4.4 TP10.1
SWCLK: J4.3 TP9.1
SWDIO: J4.2 TP8.1
USER_BUTTON: R22.2 SW2.1_2+(1_2+) SW2.2_2+(2_2+) TP11.1
NetD5_2: D5.2(A) R19.2
NetD6_2: D6.2(A) R20.2
NetD7_2: D7.2(A) R21.2

### Notes on the sheet
- Purpose: Provides SWD programming access, debug LEDs, user button, and optional signal test points for board bring-up and troubleshooting.
- STM32 CAN Telemetry PCB — Connectors and Debug
- 05
- 1 of 1
- A
- Joshua Nwaneli

### Library data of the parts
D5-D7 = CMP-1724-00002-2: as D3 on sheet 01_Power; Min Operating Temperature: -25°C; Case Code (Metric): 2012; Mount: Surface Mount; Case Code (Imperial): 0805; Height: 0.8mm; Lead Free: Lead Free; Color: Red; Package Quantity: 1; Illumination Color: Red; Lens Transparency: Diffused; Forward Current: 20mA; Packaging: Tape and Reel; Length: 2mm; Case/Package: 0805; REACH SVHC: No SVHC; Width: 1.25mm; Number of Pins: 2; Max Operating Temperature: 80°C; Dominant Wavelength: 635nm
J4 = CMP-1023-00345-1: SQ Post Socket, Through-hole, Vertical, -55 to 105 degC, 2.54mm Pitch, 5-Pin, Female, RoHS; Manufacturer: Samtec; PartNumber: SSW-105-01-T-S; Pitch: 2.54 mm; Orientation: Vertical; ComponentLink1Description: Manufacturer URL; ComponentLink1URL: http://www.samtec.com; RoHS: True; PackageDescription: Assembly, Socket Strip .016 X .031 Tail; PackageReference: SSW-105-01-X-S; ComponentLink3URL: http://www.samtec.com/documents/webfiles/cpdf/SSW-1XX-XX-XXX-X-XX-XXX-XX-MKT.pdf; Temperature Range: -55 to 105 degC; Mounting Technology: Through-hole; PackageVersion: CA, 6/1987; ComponentLink2URL: http://www.samtec.com/documents/webfiles/pdf/SSW_TH.PDF; DatasheetVersion: F-214; ComponentLink2Description: Datasheet; ComponentLink3Description: Package Specification
R19-R21 = CMP-2001-04268-1: as R1 on sheet 01_Power
R22 = CMP-03211-006861-1: as R2 on sheet 02_MCU; ComponentLink2URL: https://www.mouser.com/datasheet/2/418/NG_DS_9-1773463-9_A-1358566.pdf; Temperature Range Low: -55°C; Ipc Land Pattern Name: RESC200125X55; Device Class L2: Resistors; Automotive: No; Device Class L3: Chip SMD Resistors; Composition: Thick Film; Temperature Range High: +155°C; Temperature: -55°C to +155°C; Height: 0.65mm; Series: CRGP; RoHS: TRUE; Device Class L1: Passive Components; Octopart: https://octopart.com/crgp0805f10k-te+connectivity-91018782; Package: CRGP0805; Digikey Description: CRGP 0805 10K 1%; Ambient Temperature Range High: +70°C; Lead Free: Yes; ComponentLink2Description: Datasheet; Category: Res; Resistance: 10KΩ
SW2 = CMP-07427-000007-1: Normally open user pushbutton input; Mechanical Life: 100000Cycles; Switch Function: Off-Mom; Actuator Material: Rubber; Illumination Type: Non-Illuminated; Actuator Type: Standard; Operating Force: 300gf; Throw Configuration: SPST; Current Rating: 100mA; Voltage Rating (DC): 16V; Contact Plating: Silver; Min Operating Temperature: -55°C; Series: 7914; Package Quantity: 50; Max Operating Temperature: 125°C; Depth: 5mm; Termination: J-Hook; Mount: Surface Mount; RoHS Compliant: Yes; Case/Package: SMD/SMT; Orientation: Straight; Max Current Rating: 100mA; Packaging: Rail/Tube; Length: 5mm; Contact Material: Gold
TP8-TP11 = CMP-1672-00006-4: as TP5 on sheet 03_CAN; PackageDescription: 1-Pin Through Hole Device, Dia 3.17 mm; REACH SVHC: No SVHC; ComponentLink2Description: Datasheet; ComponentLink2URL: http://www.keyelco.com/product-pdf.cfm?p=1323; Package Quantity: 100; Colour: Yellow; Height: 8.12 mm; RoHSCompliant: true; Contact Material: Bronze; Mount: Through Hole; Contact Plating: Silver; ComponentLink1URL: http://www.keyelco.com/; Packaging: Bulk; Mounting Technology: Through Hole; PackageReference: 5014; ComponentLink1Description: Manufacturer URL; DatasheetVersion: Rev. F, 12/2013

## Nets that join several sheets
+3V3: 01_Power (5 pins), 02_MCU (12 pins), 03_CAN (C13.2 U4.3), 04_Sensors_IO (J3.2), 05_Connectors_Debug (J4.1 SW2.1_1- SW2.2_1-)
+5V: 01_Power (6 pins), 04_Sensors_IO (J3.1)
GND: 01_Power (12 pins), 02_MCU (15 pins), 03_CAN (6 pins), 04_Sensors_IO (13 pins), 05_Connectors_Debug (5 pins)
VIN_12V: 01_Power (C1.2 D1.2 TP1.1 U1.1), 03_CAN (J2.4)
ADC_IN0: 02_MCU (U3.10), 04_Sensors_IO (C14.1 R5.2 R6.2)
ADC_IN1: 02_MCU (U3.11), 04_Sensors_IO (C15.1 R7.2 R8.2)
ADC_IN2: 02_MCU (U3.12), 04_Sensors_IO (C16.1 R9.2 R10.2)
ADC_IN3: 02_MCU (U3.13), 04_Sensors_IO (C17.1 R11.2 R12.2)
CAN_RX: 02_MCU (U3.32), 03_CAN (U4.4)
CAN_TX: 02_MCU (U3.33), 03_CAN (U4.1)
DIGITAL_IN1: 02_MCU (U3.21), 04_Sensors_IO (R13.2 R14.2)
DIGITAL_IN2: 02_MCU (U3.22), 04_Sensors_IO (R15.2 R16.2)
FREQ_TIMER_IN: 02_MCU (U3.29), 04_Sensors_IO (C18.1 R17.2 R18.2)
LED_CAN: 02_MCU (U3.45), 05_Connectors_Debug (R20.1)
LED_ERROR: 02_MCU (U3.46), 05_Connectors_Debug (R21.1)
LED_STATUS: 02_MCU (U3.18), 05_Connectors_Debug (R19.1)
NRST: 02_MCU (5 pins), 05_Connectors_Debug (J4.4 TP10.1)
SWCLK: 02_MCU (U3.37), 05_Connectors_Debug (J4.3 TP9.1)
SWDIO: 02_MCU (U3.34), 05_Connectors_Debug (J4.2 TP8.1)
USER_BUTTON: 02_MCU (U3.19), 05_Connectors_Debug (R22.2 SW2.1_2+ SW2.2_2+ TP11.1)